# EAGLE design base_board5 (EAGLE 9.1.0)
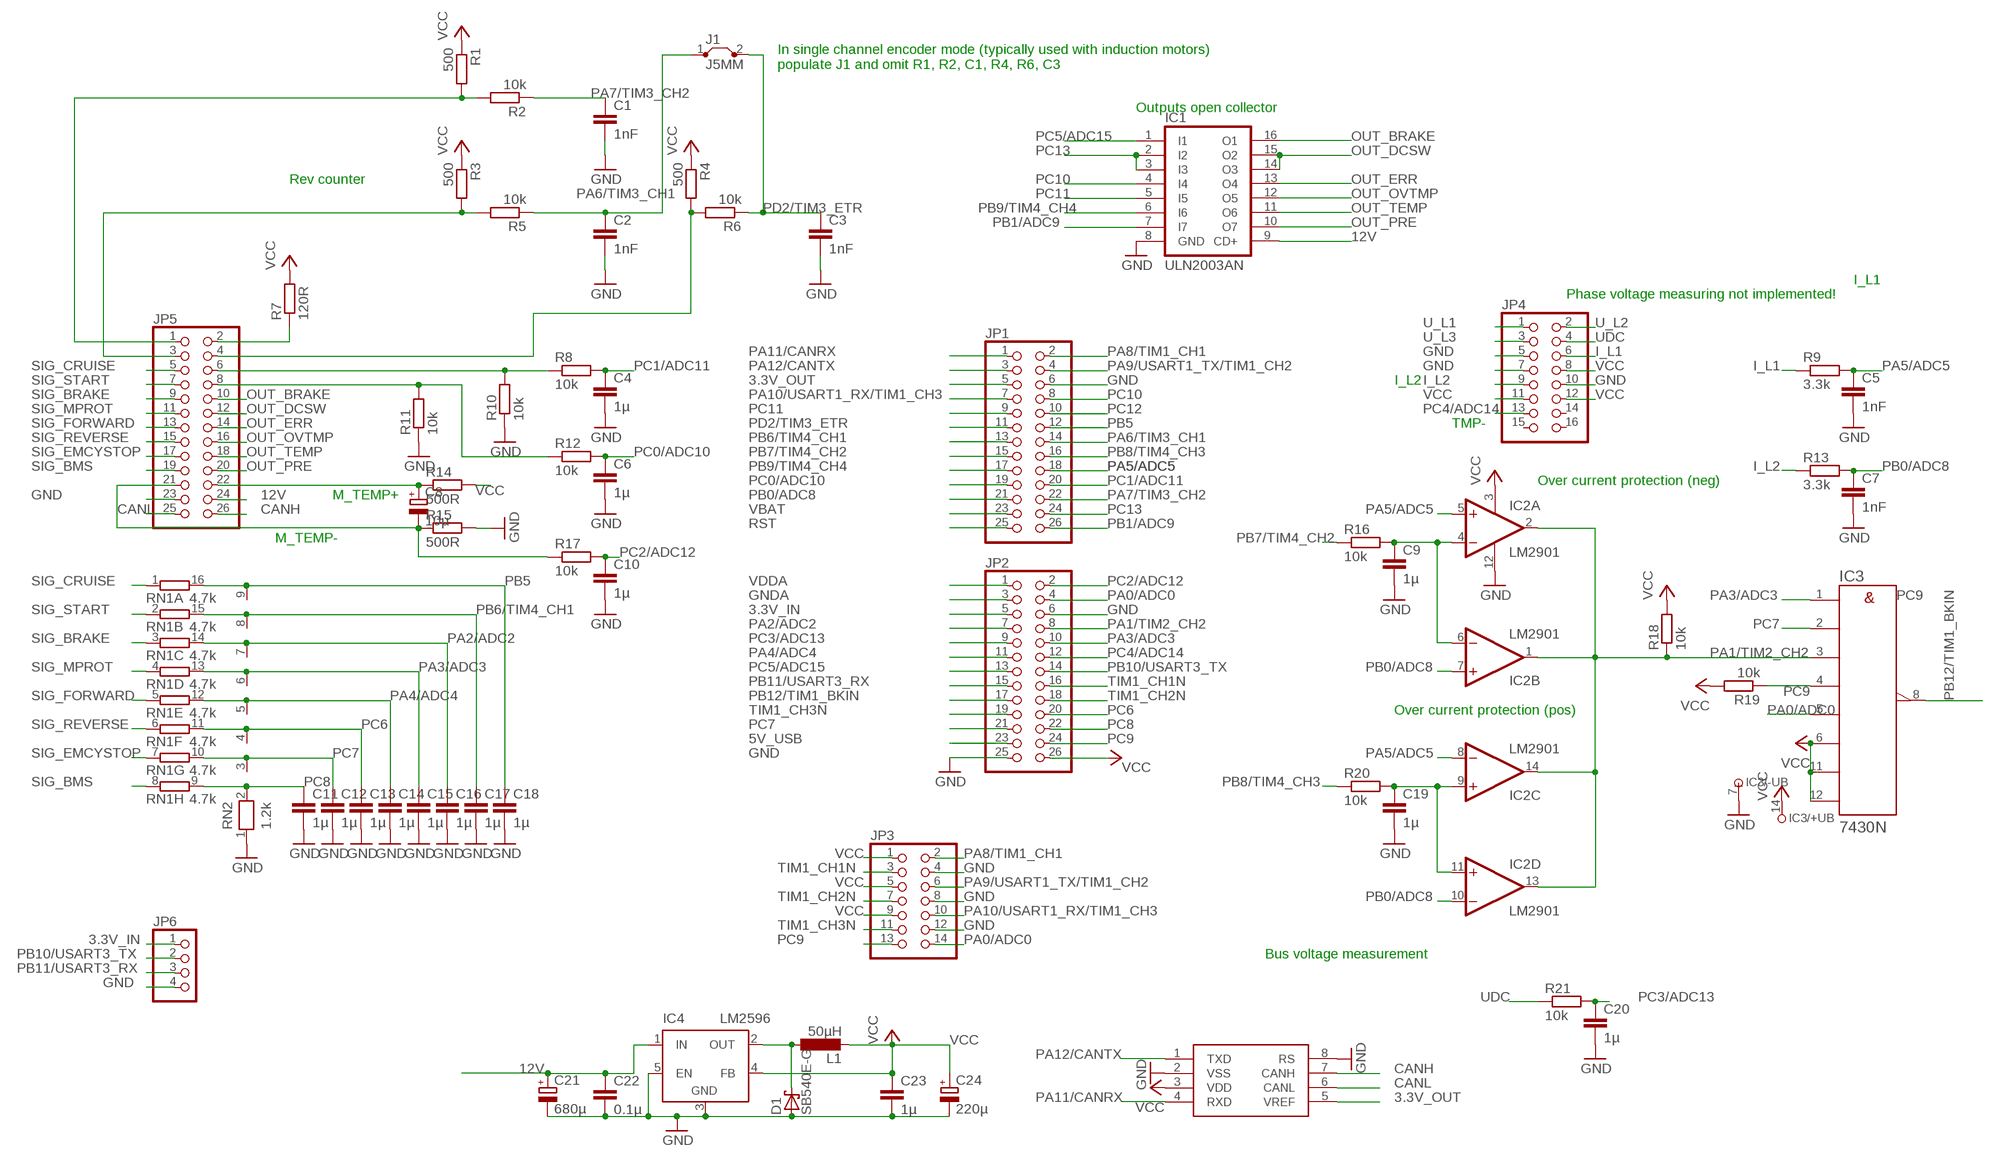
[diagram p0: schematic, sheet 1]

## Parts
C1  1nF  C-EU025-024X044  [C025-024X044]
C2  1nF  C-EU025-024X044  [C025-024X044]
C3  1nF  C-EU025-024X044  [C025-024X044]
C4  1µ  C-EU025-024X044  [C025-024X044]
C5  1nF  C-EU025-024X044  [C025-024X044]
C6  1µ  C-EU025-024X044  [C025-024X044]
C7  1nF  C-EU025-024X044  [C025-024X044]
C8  10µ  CPOL-EUE2-4  [E2-4]
C9  1µ  C-EU025-024X044  [C025-024X044]
C10  1µ  C-EU025-024X044  [C025-024X044]
C11  1µ  C-EU025-024X044  [C025-024X044]
C12  1µ  C-EU025-024X044  [C025-024X044]
C13  1µ  C-EU025-024X044  [C025-024X044]
C14  1µ  C-EU025-024X044  [C025-024X044]
C15  1µ  C-EU025-024X044  [C025-024X044]
C16  1µ  C-EU025-024X044  [C025-024X044]
C17  1µ  C-EU025-024X044  [C025-024X044]
C18  1µ  C-EU025-024X044  [C025-024X044]
C19  1µ  C-EU025-024X044  [C025-024X044]
C20  1µ  C-EU025-024X044  [C025-024X044]
C21  680µ  CPOL-EUE2.5-5  [E2,5-5]
C22  0.1µ  C-EU050-024X044  [C050-024X044]
C23  1µ  C-EU025-024X044  [C025-024X044]
C24  220µ  CPOL-EUE2-4  [E2-4]
D1  SB540E-G  SCHOTTKY-DIODEDO201T15  [DO201T15]
IC1  ULN2003AN  ULN2001AN  [DIL16]
IC2  LM2901  LM339N  [DIL14]
IC3  7430N  [DIL14]
IC4  LM2596  LM2596TV  [TO220-51]
IC5  MCP2562P  MCP2551P  [DIL08]
J1  J5MM  [05]
JP1  PINHD-2X13  [2X13]
JP2  PINHD-2X13  [2X13]
JP3  PINHD-2X7  [2X07]
JP4  PINHD-2X8  [2X08]
JP5  PINHD-2X13  [2X13]
JP6  PINHD-1X4  [1X04]
L1  50µH  L-EUTJ3-U1  [TJ3-U1]
R1  500  R-EU_0207/10  [0207/10]
R2  10k  R-EU_0207/10  [0207/10]
R3  500  R-EU_0207/10  [0207/10]
R4  500  R-EU_0207/10  [0207/10]
R5  10k  R-EU_0207/10  [0207/10]
R6  10k  R-EU_0207/10  [0207/10]
R7  120R  R-EU_0207/10  [0207/10]
R8  10k  R-EU_0207/10  [0207/10]
R9  3.3k  R-EU_0207/10  [0207/10]
R10  10k  R-EU_0207/10  [0207/10]
R11  10k  R-EU_0207/10  [0207/10]
R12  10k  R-EU_0207/10  [0207/10]
R13  3.3k  R-EU_0207/10  [0207/10]
R14  500R  R-EU_0207/10  [0207/10]
R15  500R  R-EU_0207/10  [0207/10]
R16  10k  R-EU_0207/10  [0207/10]
R17  10k  R-EU_0207/10  [0207/10]
R18  10k  R-EU_0207/10  [0207/10]
R19  10k  R-EU_0207/10  [0207/10]
R20  10k  R-EU_0207/10  [0207/10]
R21  10k  R-EU_0207/10  [0207/10]
RN1  4.7k  8R-N  [DIL16]
RN2  1.2k  RN08  [RN-9]

## Nets
3.3V_IN: JP2.5 JP6.1
3.3V_OUT: IC5.5(VREF) JP1.5
5V_USB: JP2.23
12V: C21.+ C22.1 IC1.9(CD+) IC4.1(IN) JP5.24
CANH: IC5.7(CANH) JP5.26
CANL: IC5.6(CANL) JP5.25
GND: C1.2 C2.2 C3.2 C4.2 C5.2 C6.2 C7.2 C9.2 C10.2 C11.2 C12.2 C13.2 C14.2 C15.2 C16.2 C17.2 C18.2 C19.2 C20.2 C21.- C22.2 C23.2 C24.- D1.A IC1.8(GND) IC2.12(P:GND) IC3.7(-UB) IC4.3(GND) IC4.5(EN) IC5.2(VSS) IC5.8(RS) JP1.6 JP2.6 JP2.25 JP3.4 JP3.8 JP3.12 JP4.5 JP4.7 JP4.10 JP5.23 JP6.4 R10.1 R11.1 R15.2 RN2.1
GNDA: JP2.3
I_L1: JP4.6 R9.1
I_L2: JP4.9 R13.1
N$3: JP5.2 R7.1
N$5: JP5.3 R3.2 R5.2
N$8: JP5.1 R1.2 R2.2
N$10: C19.1 IC2.9(C:+IN) IC2.11(D:+IN) R20.2
N$11: JP5.4 R4.2 R6.2
N$13: C8.+ JP5.22 R14.1
N$14: D1.C IC4.2(OUT) L1.1
N$15: C9.1 IC2.4(A:-IN) IC2.6(B:-IN) R16.2
N$16: C8.- JP5.21 R15.1 R17.1
OUT_BRAKE: IC1.16(O1) JP5.10
OUT_DCSW: IC1.14(O3) IC1.15(O2) JP5.12
OUT_ERR: IC1.13(O4) JP5.14
OUT_OVTMP: IC1.12(O5) JP5.16
OUT_PRE: IC1.10(O7) JP5.20
OUT_TEMP: IC1.11(O6) JP5.18
PA0/ADC0: IC3.5(E) JP2.4 JP3.14
PA1/TIM2_CH2: IC2.1(B:OUT) IC2.2(A:OUT) IC2.13(D:OUT) IC2.14(C:OUT) IC3.3(C) JP2.8 R18.1
PA2/ADC2: C16.1 JP2.7 RN1.14 RN2.7
PA3/ADC3: C15.1 IC3.1(A) JP2.10 RN1.13 RN2.6
PA4/ADC4: C14.1 JP2.11 RN1.12 RN2.5
PA5/ADC5: C5.1 IC2.5(A:+IN) IC2.8(C:-IN) JP1.18 R9.2
PA6/TIM3_CH1: C2.1 J1.1 JP1.14 R5.1
PA7/TIM3_CH2: C1.1 JP1.22 R2.1
PA8/TIM1_CH1: JP1.2 JP3.2
PA9/USART1_TX/TIM1_CH2: JP1.4 JP3.6
PA10/USART1_RX/TIM1_CH3: JP1.7 JP3.10
PA11/CANRX: IC5.4(RXD) JP1.1
PA12/CANTX: IC5.1(TXD) JP1.3
PB0/ADC8: C7.1 IC2.7(B:+IN) IC2.10(D:-IN) JP1.21 R13.2
PB1/ADC9: IC1.7(I7) JP1.26
PB5: C18.1 JP1.12 RN1.16 RN2.9
PB6/TIM4_CH1: C17.1 JP1.13 RN1.15 RN2.8
PB7/TIM4_CH2: JP1.15 R16.1
PB8/TIM4_CH3: JP1.16 R20.1
PB9/TIM4_CH4: IC1.6(I6) JP1.17
PB10/USART3_TX: JP2.14 JP6.2
PB11/USART3_RX: JP2.15 JP6.3
PB12/TIM1_BKIN: IC3.8(Y) JP2.17
PC0/ADC10: C6.1 JP1.19 R12.2
PC1/ADC11: C4.1 JP1.20 R8.2
PC2/ADC12: C10.1 JP2.2 R17.2
PC3/ADC13: C20.1 JP2.9 R21.2
PC4/ADC14: JP2.12 JP4.13
PC5/ADC15: IC1.1(I1) JP2.13
PC6: C13.1 JP2.20 RN1.11 RN2.4
PC7: C12.1 IC3.2(B) JP2.21 RN1.10 RN2.3
PC8: C11.1 JP2.22 RN1.9 RN2.2
PC9: IC3.4(D) JP2.24 JP3.13 R19.1
PC10: IC1.4(I4) JP1.8
PC11: IC1.5(I5) JP1.9
PC12: JP1.10
PC13: IC1.2(I2) IC1.3(I3) JP1.24
PD2/TIM3_ETR: C3.1 J1.2 JP1.11 R6.1
RST: JP1.25
SIG_BMS: JP5.19 RN1.8
SIG_BRAKE: JP5.9 RN1.3
SIG_CRUISE: JP5.5 RN1.1
SIG_EMCYSTOP: JP5.17 RN1.7
SIG_FORWARD: JP5.13 RN1.5
SIG_MPROT: JP5.11 RN1.4
SIG_REVERSE: JP5.15 RN1.6
SIG_START: JP5.7 RN1.2
TIM1_CH1N: JP2.16 JP3.3
TIM1_CH2N: JP2.18 JP3.7
TIM1_CH3N: JP2.19 JP3.11
U_L1: JP4.1
U_L2: JP4.2
U_L3: JP4.3
UDC: JP4.4 R21.1
VBAT: JP1.23
VCC: C23.1 C24.+ IC2.3(P:V+) IC3.6(F) IC3.11(G) IC3.12(H) IC3.14(+UB) IC4.4(FB) IC5.3(VDD) JP2.26 JP3.1 JP3.5 JP3.9 JP4.8 JP4.11 JP4.12 L1.2 R1.1 R3.1 R4.1 R7.2 R14.2 R18.2 R19.2
VDDA: JP2.1
X: JP5.6 R8.1 R10.2
Y: JP5.8 R11.2 R12.1
Unconnected: JP4.14 JP4.15 JP4.16

## Notes on the sheet
- In single channel encoder mode (typically used with induction motors)
  populate J1 and omit R1, R2, C1, R4, R6, C3
- Outputs open collector
- Rev counter
- I_L1
- Phase voltage measuring not implemented!
- I_L2
- TMP-
- Over current protection (neg)
- M_TEMP+
- M_TEMP-
- Over current protection (pos)
- Bus voltage measurement

## Library data of the parts
C1-C7 C9-C20 C22 C23 = rcl:C-EU: CAPACITOR, European symbol
C8 C21 C24 = rcl:CPOL-EU: POLARIZED CAPACITOR, European symbol
D1 = diode:SCHOTTKY-DIODE: Schottky Diode
IC1 = uln-udn:ULN2001A: DRIVER ARRAY
IC2 = linear:LM339: Low Power Low Offset Voltage Quad Comparators with open collector; LM139/LM239/LM339/LM2901/LM3302
IC3 = 74ttl-din:74*30: 8-input NAND gate
IC4 = linear:LM2596T: STEP-DOWN VOLTAGE REGULATOR
IC5 = SparkFun-DigitalIC:MCP2551: CAN transceiver
J1 = jumper:J: Bridge
JP1 JP2 JP5 = pinhead:PINHD-2X13: PIN HEADER
JP3 = pinhead:PINHD-2X7: PIN HEADER
JP4 = pinhead:PINHD-2X8: PIN HEADER
JP6 = pinhead:PINHD-1X4: PIN HEADER
L1 = rcl:L-EU: INDUCTOR, European symbol
R1-R21 = rcl:R-EU_: RESISTOR, European symbol
RN1 = resistor-dil:8R-N: DIL RESISTOR
RN2 = resistor-net:RN08: RESISTOR NETWORK

## Board
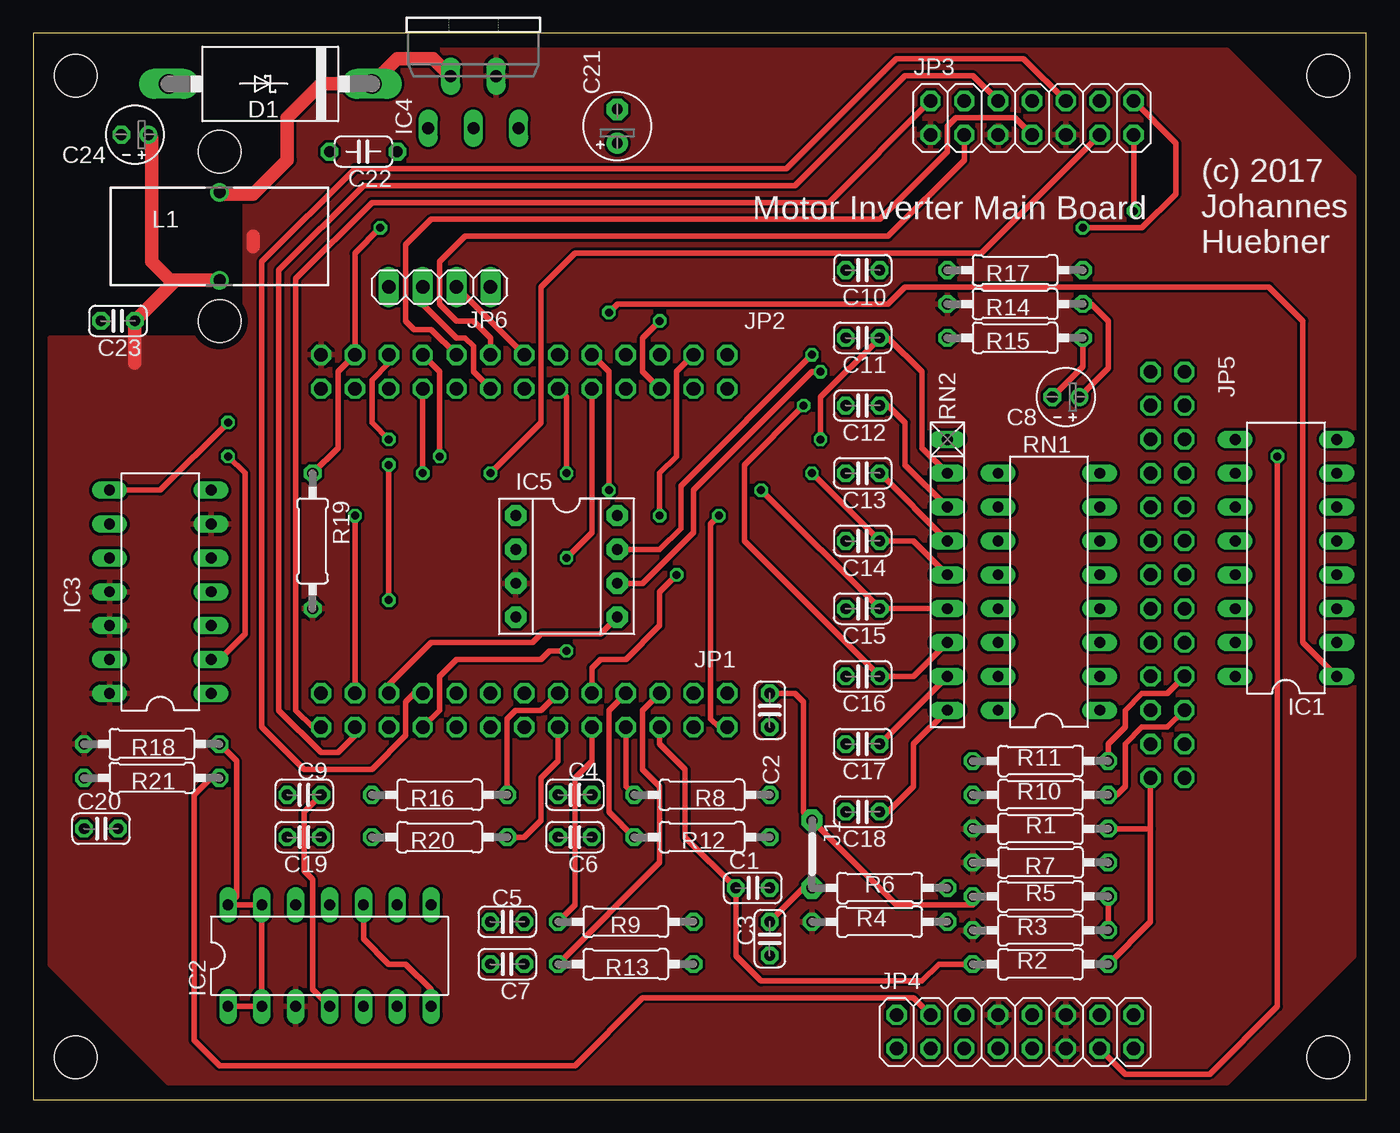
[diagram p1: board, top side]
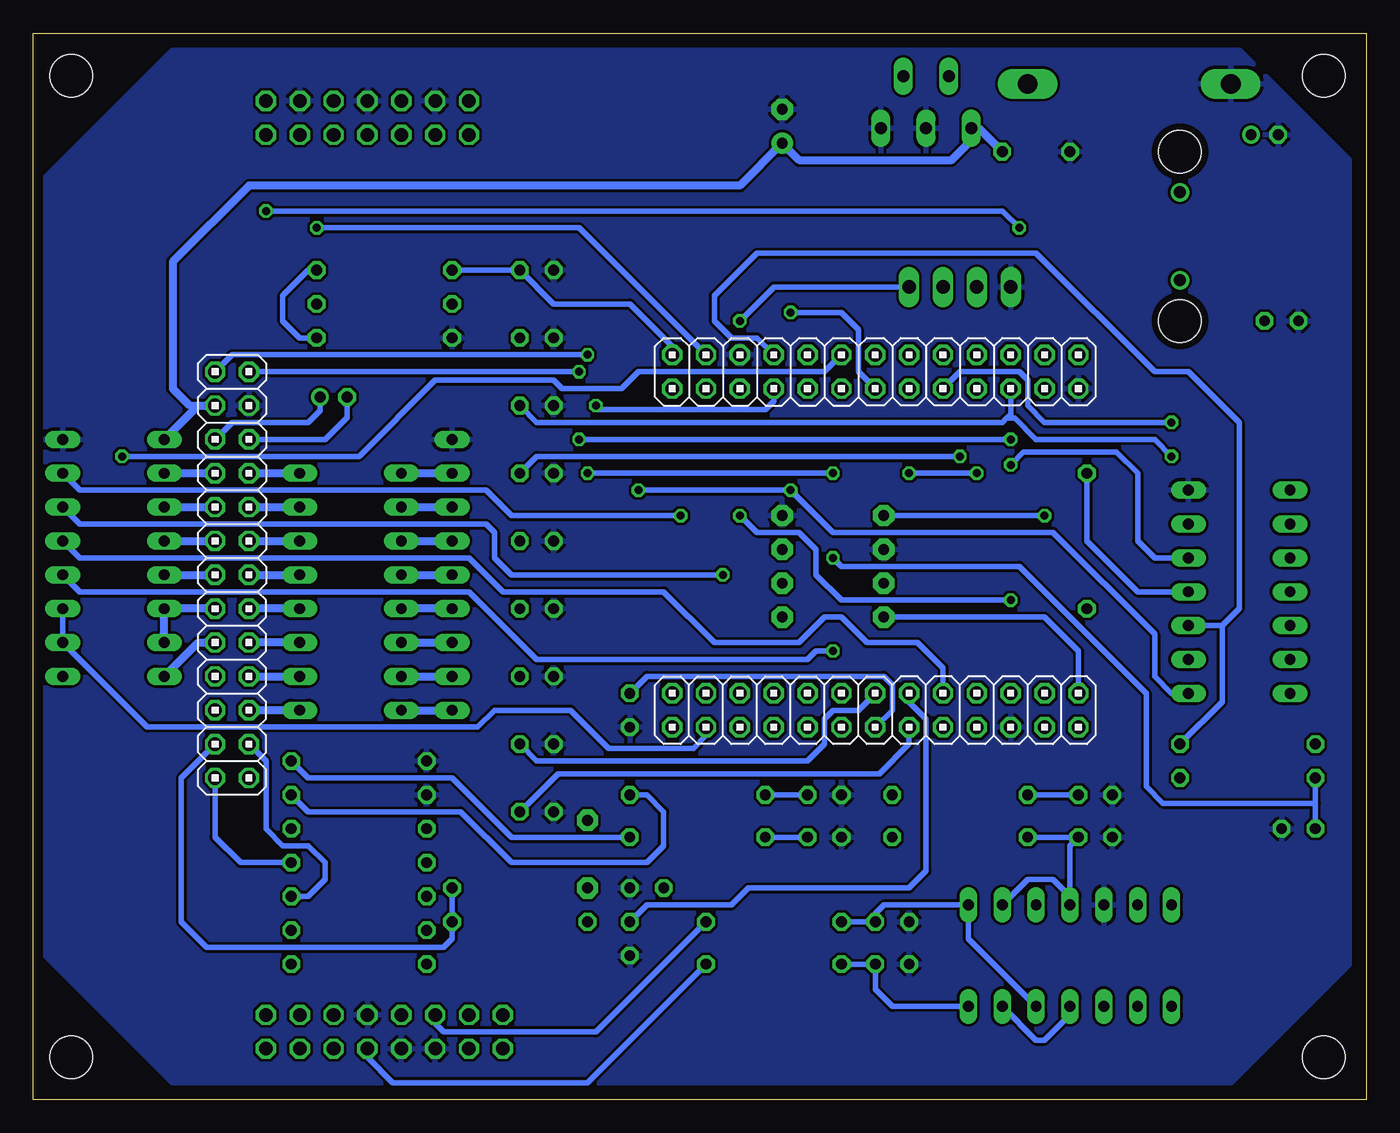
[diagram p2: board, bottom side, seen from below]

Size 100 x 80 mm. Coordinates in mm from the lower left corner, seen from the top.
Outline: 0,0 100,0 100,80 0,80 0,0
Copper layers (1*16): Top 0.035mm / dielectric 1.5mm / Bottom 0.035mm
Design rules "default *": minimum track width 10mil, minimum drill 20mil, track to track 0.2mm, track to pad 0.2mm, pad to pad 0.2mm, via to via 0.2mm, smd to smd 0.2mm, copper to edge 20mil, drill to drill 8mil, minimum pad ring 10mil, minimum via ring 8mil, stop-mask expansion 4mil, vias tented up to drill 0mil, thermal gap 10mil
Holes 3.2 mm at 3.17,76.83 3.17,3.17 97.16,3.17 97.16,76.83 13.97,71.12 13.97,58.42

### Footprints (pad centres in the part's own frame; a part is rotated, then mirrored left to right if it is on the bottom)
C025-024X044 = drill 0.813 octagon: 1 -1.27,0; 2 1.27,0
E2-4 = drill 0.813 pad 1.27: + -1.016,0 | drill 0.813 pad 1.27 octagon: - 1.016,0
E2,5-5 = drill 0.813 pad 1.6: + -1.27,0 | drill 0.813 pad 1.6 octagon: - 1.27,0
C050-024X044 = drill 0.813 octagon: 1 -2.54,0; 2 2.54,0
DO201T15 = drill 1.499 long: A 7.62,0; C -7.62,0
DIL16 = drill 0.813 long: 1 -8.89,-3.81; 2 -6.35,-3.81; 3 -3.81,-3.81; 4 -1.27,-3.81; 5 1.27,-3.81; 6 3.81,-3.81; 7 6.35,-3.81; 8 8.89,-3.81; 9 8.89,3.81; 10 6.35,3.81; 11 3.81,3.81; 12 1.27,3.81; 13 -1.27,3.81; 14 -3.81,3.81; 15 -6.35,3.81; 16 -8.89,3.81
DIL14 = drill 0.813 long: 1 -7.62,-3.81; 2 -5.08,-3.81; 3 -2.54,-3.81; 4 0,-3.81; 5 2.54,-3.81; 6 5.08,-3.81; 7 7.62,-3.81; 8 7.62,3.81; 9 5.08,3.81; 10 2.54,3.81; 11 0,3.81; 12 -2.54,3.81; 13 -5.08,3.81; 14 -7.62,3.81
TO220-51 = drill 0.9 long: 1 -3.4,-8.4; 2 -1.7,-4.5; 3 0,-8.4; 4 1.7,-4.5; 5 3.4,-8.4
DIL08 = drill 0.813 pad 1.6 octagon: 1 -3.81,-3.81; 2 -1.27,-3.81; 3 1.27,-3.81; 4 3.81,-3.81; 5 3.81,3.81; 6 1.27,3.81; 7 -1.27,3.81; 8 -3.81,3.81
05 = drill 0.813 pad 1.6 octagon: 1 -2.54,0; 2 2.54,0
2X13 = drill 1.016 octagon: 1 -15.24,-1.27; 2 -15.24,1.27; 3 -12.7,-1.27; 4 -12.7,1.27; 5 -10.16,-1.27; 6 -10.16,1.27; 7 -7.62,-1.27; 8 -7.62,1.27; 9 -5.08,-1.27; 10 -5.08,1.27; 11 -2.54,-1.27; 12 -2.54,1.27; 13 0,-1.27; 14 0,1.27; 15 2.54,-1.27; 16 2.54,1.27; 17 5.08,-1.27; 18 5.08,1.27; 19 7.62,-1.27; 20 7.62,1.27; 21 10.16,-1.27; 22 10.16,1.27; 23 12.7,-1.27; 24 12.7,1.27; 25 15.24,-1.27; 26 15.24,1.27
2X07 = drill 1.016 octagon: 1 -7.62,-1.27; 2 -7.62,1.27; 3 -5.08,-1.27; 4 -5.08,1.27; 5 -2.54,-1.27; 6 -2.54,1.27; 7 0,-1.27; 8 0,1.27; 9 2.54,-1.27; 10 2.54,1.27; 11 5.08,-1.27; 12 5.08,1.27; 13 7.62,-1.27; 14 7.62,1.27
2X08 = drill 1.016 octagon: 1 -8.89,-1.27; 2 -8.89,1.27; 3 -6.35,-1.27; 4 -6.35,1.27; 5 -3.81,-1.27; 6 -3.81,1.27; 7 -1.27,-1.27; 8 -1.27,1.27; 9 1.27,-1.27; 10 1.27,1.27; 11 3.81,-1.27; 12 3.81,1.27; 13 6.35,-1.27; 14 6.35,1.27; 15 8.89,-1.27; 16 8.89,1.27
1X04 = drill 1.016 long: 1 -3.81,0; 2 -1.27,0; 3 1.27,0; 4 3.81,0
TJ3-U1 = drill 0.9: 1 -3.3,0; 2 3.3,0
0207/10 = drill 0.813 octagon: 1 -5.08,0; 2 5.08,0
RN-9 = drill 0.813 long: 1 -10.16,0; 2 -7.62,0; 3 -5.08,0; 4 -2.54,0; 5 0,0; 6 2.54,0; 7 5.08,0; 8 7.62,0; 9 10.16,0

### Placement (x,y rotation side)
C1  53.98,15.88 0 top
C2  55.24,29.21 270 top
C3  55.24,12.06 270 top
C4  40.64,22.86 180 top
C5  35.56,13.34 180 top
C6  40.64,19.68 180 top
C7  35.56,10.16 180 top
C8  77.47,52.7 180 top
C9  20.32,22.86 180 top
C10  62.23,62.23 180 top
C11  62.23,57.15 180 top
C12  62.23,52.07 180 top
C13  62.23,46.99 180 top
C14  62.23,41.91 180 top
C15  62.23,36.83 180 top
C16  62.23,31.75 180 top
C17  62.23,26.67 180 top
C18  62.23,21.59 180 top
C19  20.32,19.68 180 top
C20  5.08,20.32 0 top
C21  43.81,73.03 90 top
C22  24.77,71.12 180 top
C23  6.35,58.42 180 top
C24  7.62,72.39 180 top
D1  17.78,76.2 180 top
IC1  93.98,40.64 90 top
IC2  22.23,10.79 0 top
IC3  9.53,38.1 90 top
IC4  33.02,81.28 0 top
IC5  40.01,40.01 270 top
J1  58.42,18.41 270 top
JP1  36.83,29.21 180 bottom
JP2  36.83,54.61 0 bottom
JP3  74.93,73.66 0 top
JP4  73.66,5.08 0 top
JP5  85.09,39.37 90 bottom
JP6  30.48,60.96 180 top
L1  13.97,64.77 270 top
R1  75.56,20.32 0 top
R2  75.56,10.16 0 top
R3  75.56,12.7 0 top
R4  63.5,13.34 0 top
R5  75.56,15.24 0 top
R6  63.5,15.88 0 top
R7  75.56,17.78 180 top
R8  50.16,22.86 180 top
R9  44.45,13.34 180 top
R10  75.56,22.86 0 top
R11  75.56,25.4 0 top
R12  50.16,19.68 180 top
R13  44.45,10.16 180 top
R14  73.66,59.69 180 top
R15  73.66,57.15 180 top
R16  30.48,22.86 180 top
R17  73.66,62.23 180 top
R18  8.89,26.67 180 top
R19  20.95,41.91 270 top
R20  30.48,19.68 180 top
R21  8.89,24.13 180 top
RN1  76.2,38.1 90 top
RN2  68.58,39.37 270 top

### Tracks (layer width: path | path; a pad name or v marks a point on that pad's centre or on a via)
3.3V_IN  (via drill 0.6)
  Top 0.406: JP2.5 45.72,54.61 45.72,57.15 v46.99,58.42
  Bottom 0.406: JP6.1 44.45,60.96 v46.99,58.42
3.3V_OUT
  Top 0.406: IC5.5 42.55,34.92 38.1,34.92 37.47,34.29 29.84,34.29 26.67,31.11 JP1.5
12V
  Bottom 0.61: IC1.9 87.63,52.07 | 87.63,52.07 JP5.24 | 87.63,52.07 88.27,52.07 89.53,53.34 89.53,62.87 83.82,68.58 46.99,68.58 C21.+ 42.55,70.48 31.11,70.48 29.62,71.98 IC4.1 29.07,72.88 C22.1
CANH  (via drill 0.6)
  Top 0.406: v58.42,55.88 48.58,46.03 48.58,42.86 46.99,41.27 IC5.7
  Bottom 0.406: JP5.26 85.09,55.88 v58.42,55.88
CANL  (via drill 0.6)
  Top 0.406: v59.05,54.61 58.42,54.61 49.53,45.72 49.53,42.55 45.72,38.73 IC5.6
  Bottom 0.406: JP5.25 v59.05,54.61
GND
  pour Bottom: 1.27,70.48 9.53,78.74 88.27,78.74 89.53,78.74 99.06,69.22 99.06,10.79 89.53,1.27 10.16,1.27 1.27,10.16
I_L1
  Bottom 0.406: R9.1 57.78,5.08 69.22,5.08 69.85,5.71 JP4.6
I_L2
  Bottom 0.406: R13.1 58.42,1.27 73.03,1.27 74.93,3.17 JP4.9
N$3
  Bottom 0.406: JP5.2 86.36,19.68 84.45,17.78 R7.1
N$5
  Top 0.406: R5.2 R3.2
  Bottom 0.406: JP5.3 82.55,25.4 82.55,20.32 81.28,19.05 79.38,19.05 78.11,17.78 78.11,16.51 79.38,15.24 R5.2
N$8
  Top 0.406: R2.2 83.82,13.34 83.82,20.32 | 83.82,20.32 JP5.1 | R1.2 83.82,20.32
N$10
  Bottom 0.406: R20.2 C19.1 22.23,19.05 22.23,15.24 | IC2.9 25.4,16.51 23.5,16.51 22.23,15.24 | 22.23,15.24 IC2.11
N$11
  Bottom 0.406: R6.2 R4.2 68.58,12.06 69.22,11.43 87,11.43 88.9,13.34 88.9,24.13 JP5.4
N$13
  Top 0.406: C8.+ 80.64,54.86 80.64,58.42 79.38,59.69 R14.1
  Bottom 0.406: JP5.22 85.09,50.8 79.38,50.8 78.49,51.69 C8.+
N$14
  Top 1.016: IC4.2 30,78.11 27.3,78.11 D1.C 21.59,76.2 19.05,73.66 19.05,70.48 16.51,67.94 14.1,67.94 L1.1
N$15
  Top 0.406: IC2.4 20.95,8.26 20.95,16.51 20.32,17.14 20.32,21.59 C9.1
  Bottom 0.406: R16.2 C9.1 | IC2.6 24.77,4.45 24.13,4.45 22.23,6.35 IC2.4
N$16
  Top 0.406: C8.- 78.74,54.99 R15.1
  Bottom 0.406: JP5.21 78.11,49.53 76.45,51.18 C8.- | R17.1 79.38,62.23 81.28,60.33 81.28,58.42 80.01,57.15 R15.1
OUT_BRAKE
  Bottom 0.61: IC1.16 87.63,34.29 JP5.10
OUT_DCSW
  Bottom 0.61: JP5.12 IC1.14 IC1.15
OUT_ERR
  Bottom 0.61: IC1.13 JP5.14
OUT_OVTMP
  Bottom 0.61: IC1.12 JP5.16
OUT_PRE
  Bottom 0.61: IC1.10 JP5.20
OUT_TEMP
  Bottom 0.61: IC1.11 JP5.18
PA0/ADC0  (via drill 0.6)
  Top 0.406: JP3.14 85.72,71.75 85.72,67.94 83.19,65.41 v78.74,65.41 | JP2.4 48.26,54.61 48.26,48.26 46.99,46.99 v46.99,43.81 | v26.67,37.47 v26.67,47.62
  Bottom 0.406: v78.74,65.41 59.05,65.41 JP2.4 | v46.99,43.81 45.72,42.55 42.55,42.55 41.27,41.27 41.27,39.37 39.37,37.47 v26.67,37.47 | v26.67,47.62 25.72,48.58 18.73,48.58 17.14,46.99 17.14,41.91 15.88,40.64 IC3.5
PA1/TIM2_CH2
  Top 0.406: IC2.1 IC2.2 IC2.13 IC2.14 15.24,15.24 15.24,25.4 R18.1
  Bottom 0.406: JP2.8 45.72,57.15 47.62,57.15 48.9,58.42 48.9,60.33 45.72,63.5 24.77,63.5 15.88,54.61 13.34,54.61 9.53,50.8 9.53,36.83 10.79,35.56 | 10.79,35.56 IC3.3 | R18.1 10.79,29.84 10.79,35.56
PA2/ADC2  (via drill 0.6)
  Top 0.406: RN2.7 66.04,31.75 C16.1 53.34,41.91 53.34,47.62 v57.78,52.07
  Bottom 0.406: v57.78,52.07 57.47,51.76 45.09,51.76 44.45,52.39 JP2.7
  Bottom 0.61: RN1.14 RN2.7
PA3/ADC3  (via drill 0.6)
  Top 0.406: RN2.6 C15.1 v54.61,45.72 | v43.18,45.72 43.18,54.61 JP2.10
  Bottom 0.406: v54.61,45.72 v43.18,45.72 40.01,42.55 23.5,42.55 15.88,34.92 15.88,31.75 14.61,30.48 IC3.1
  Bottom 0.61: RN2.6 RN1.13
PA4/ADC4  (via drill 0.6)
  Top 0.406: RN2.5 66.04,41.91 C14.1 v58.42,46.99 | v40.01,46.99 40.01,52.7 JP2.11
  Bottom 0.406: v58.42,46.99 v40.01,46.99
  Bottom 0.61: RN1.12 RN2.5
PA5/ADC5
  Top 0.406: R9.2 40.64,14.61 40.64,24.13 41.91,25.4 JP1.18
  Bottom 0.406: R9.2 C5.1 36.83,13.97 36.2,14.61 IC2.8 29.84,12.06 IC2.5
PA6/TIM3_CH1
  Top 0.406: C2.1 57.15,30.48 57.78,29.84 57.78,21.59 J1.1 64.77,14.61 70.48,14.61 R5.1
  Bottom 0.406: C2.1 53.98,31.75 36.2,31.75 35.56,31.11 35.56,29.21 JP1.14
PA7/TIM3_CH2
  Top 0.406: R2.1 67.94,10.16 66.67,8.89 54.61,8.89 52.7,10.79 C1.1 48.9,19.68 48.9,24.77 46.99,26.67 JP1.22
PA8/TIM1_CH1
  Top 0.406: JP3.2 59.69,67.31 25.4,67.31 19.68,61.59 19.68,29.21 20.95,27.94 JP1.2
PA9/USART1_TX/TIM1_CH2
  Top 0.406: JP3.6 70.48,76.83 65.41,76.83 57.15,68.58 24.77,68.58 18.41,62.23 18.41,29.21 21.59,26.04 22.86,26.04 24.13,27.3 JP1.4
PA10/USART1_RX/TIM1_CH3
  Top 0.406: JP3.10 74.3,78.11 64.77,78.11 56.52,69.85 24.13,69.85 17.14,62.87 17.14,27.94 20.32,24.77 25.4,24.77 27.94,27.3 27.94,29.84 28.57,30.48 JP1.7
PA11/CANRX
  Bottom 0.406: IC5.4 24.13,36.2 21.59,33.66 JP1.1
PA12/CANTX  (via drill 0.6)
  Top 0.406: v24.13,43.81 JP1.3
  Bottom 0.406: IC5.1 v24.13,43.81
PB0/ADC8
  Top 0.406: IC2.10 24.77,12.06 26.67,10.16 27.94,10.16 29.84,8.26 IC2.7 | JP1.21 45.72,29.21 45.72,24.77 46.99,23.5 46.99,17.78 R13.2
  Bottom 0.406: R13.2 C7.1 36.83,8.26 35.56,6.99 IC2.7
PB1/ADC9  (via drill 0.6)
  Top 0.406: v51.44,43.81 50.8,43.18 50.8,28.57 51.44,27.94 JP1.26
  Bottom 0.406: IC1.7 96.52,45.72 66.04,45.72 64.14,43.81 v51.44,43.81
PB5
  Top 0.406: RN2.9 66.04,26.67 66.04,23.5 64.14,21.59 C18.1
  Bottom 0.406: C18.1 60.65,24.45 36.52,24.45 34.29,26.67 JP1.12
  Bottom 0.61: RN1.16 RN2.9
PB6/TIM4_CH1
  Top 0.406: RN2.8 C17.1
  Bottom 0.406: C17.1 62.23,25.4 41.91,25.4 40.64,26.67 40.64,28.57 40.01,29.21 38.1,29.21 JP1.13
  Bottom 0.61: RN1.15 RN2.8
PB7/TIM4_CH2
  Top 0.406: R16.1 35.56,28.57 36.2,29.21 38.1,29.21 JP1.15
PB8/TIM4_CH3
  Top 0.406: JP1.16 39.37,25.4 38.1,24.13 38.1,20.95 36.83,19.68 R20.1
PB9/TIM4_CH4  (via drill 0.6)
  Top 0.406: v48.26,39.37 46.99,38.1 46.99,35.56 44.45,33.02 42.55,33.02 41.91,32.38 JP1.17
  Bottom 0.406: IC1.6 96.52,43.18 66.04,43.18 65.41,42.55 65.41,40.64 64.14,39.37 v48.26,39.37
PB10/USART3_TX
  Top 0.406: JP6.2 JP2.14
PB11/USART3_RX
  Top 0.406: JP6.3 29.21,59.69 31.75,57.15 32.38,57.15 33.02,56.52 33.02,54.61 JP2.15
PB12/TIM1_BKIN  (via drill 0.6)
  Top 0.406: v14.61,50.8 9.53,45.72 IC3.8
  Bottom 0.406: JP2.17 30.48,54.61 26.04,54.61 25.4,53.98 25.4,52.07 24.13,50.8 v14.61,50.8
PC0/ADC10
  Top 0.406: R12.2 43.18,21.59 43.18,29.21 JP1.19
  Bottom 0.406: R12.2 C6.1
PC1/ADC11
  Top 0.406: R8.2 44.45,23.5 JP1.20
  Bottom 0.406: R8.2 C4.1
PC2/ADC12
  Bottom 0.406: R17.2 C10.1 60.96,59.69 55.24,59.69 52.07,56.52 JP2.2
PC3/ADC13  (via drill 0.6)
  Top 0.406: JP2.9 41.91,42.55 v40.01,40.64
  Bottom 0.406: v40.01,40.64 39.37,40.01 26.04,40.01 16.51,30.48 16.51,23.5 15.24,22.23 3.81,22.23 | 3.81,22.23 R21.2 | C20.1 3.81,22.23
PC4/ADC14  (via drill 0.6)
  Top 0.406: JP4.13 81.92,1.91 88.27,1.91 93.34,6.99 v93.34,48.26
  Bottom 0.406: v93.34,48.26 75.56,48.26 69.85,53.98 60.96,53.98 60.33,53.34 55.88,53.34 54.61,54.61 40.64,54.61 JP2.12
PC5/ADC15  (via drill 0.6)
  Top 0.406: IC1.1 95.25,34.29 95.25,58.42 92.71,60.96 65.41,60.96 64.14,59.69 43.81,59.69 v43.18,59.05
  Bottom 0.406: v43.18,59.05 39.37,59.05 38.1,57.78 38.1,54.61 JP2.13
PC6  (via drill 0.6)
  Top 0.406: RN2.4 C13.1 | v30.48,48.26 30.48,54.61 JP2.20
  Bottom 0.406: C13.1 62.23,48.26 v30.48,48.26
  Bottom 0.61: RN1.11 RN2.4
PC7  (via drill 0.6)
  Top 0.406: RN2.3 65.41,47.62 65.41,50.8 64.14,52.07 C12.1 | v14.61,48.26 15.88,46.99 15.88,34.92 13.97,33.02 IC3.2
  Bottom 0.406: C12.1 62.23,50.8 27.3,50.8 26.99,51.12 | 26.99,51.12 26.67,51.44 JP2.21 | v14.61,48.26 15.88,49.53 24.77,49.53 26.35,51.12 26.99,51.12
  Bottom 0.61: RN1.10 RN2.3
PC8  (via drill 0.6)
  Top 0.406: RN2.2 66.67,48.9 66.67,54.61 64.14,57.15 C11.1 59.05,52.7 v59.05,49.53 | v26.67,49.53 25.4,50.8 25.4,53.98 26.67,55.24 JP2.22
  Bottom 0.406: v59.05,49.53 v26.67,49.53
  Bottom 0.61: RN1.9 RN2.2
PC9  (via drill 0.6)
  Top 0.406: JP3.13 v82.55,66.67 | v26.04,65.41 24.13,63.5 JP2.24 22.86,54.61 22.86,48.9 R19.1
  Bottom 0.406: v82.55,66.67 27.3,66.67 v26.04,65.41 | R19.1 20.95,41.91 17.14,38.1 IC3.4
PC10  (via drill 0.6)
  Top 0.406: v40.01,33.66 38.73,33.66 38.1,33.02 31.75,33.02 30.48,31.75 30.48,29.21 JP1.8
  Bottom 0.406: IC1.4 96.52,38.1 67.31,38.1 62.23,33.02 41.91,33.02 41.27,33.66 v40.01,33.66
PC11
  Bottom 0.406: IC1.5 96.52,40.64 67.31,40.64 64.77,38.1 52.7,38.1 48.9,34.29 42.55,34.29 40.64,36.2 39.37,36.2 37.47,34.29 33.66,34.29 31.75,32.38 JP1.9
PC13
  Bottom 0.406: IC1.3 IC1.2 91.44,27.94 66.67,27.94 65.41,29.21 59.69,29.21 56.83,26.35 50.48,26.35 49.53,27.3 JP1.24
PD2/TIM3_ETR
  Top 0.406: C3.1 57.78,15.88 J1.2
  Bottom 0.406: C3.1 53.98,14.61 47.62,14.61 46.35,15.88 34.29,15.88 33.02,17.14 33.02,28.57 34.29,29.84 JP1.11
SIG_BMS
  Bottom 0.61: JP5.19 RN1.8
SIG_BRAKE
  Bottom 0.61: RN1.3 JP5.9
SIG_CRUISE
  Bottom 0.61: RN1.1 JP5.5
SIG_EMCYSTOP
  Bottom 0.61: JP5.17 RN1.7
SIG_FORWARD
  Bottom 0.61: JP5.13 RN1.5
SIG_MPROT
  Bottom 0.61: RN1.4 JP5.11
SIG_REVERSE
  Bottom 0.61: JP5.15 RN1.6
SIG_START
  Bottom 0.61: JP5.7 RN1.2
TIM1_CH1N
  Top 0.406: JP2.16 34.29,57.15 33.02,58.42 31.75,58.42 30.48,59.69 30.48,62.87 32.38,64.77 64.14,64.77 69.85,70.48 JP3.3
TIM1_CH2N
  Top 0.406: JP3.7 73.66,73.66 69.22,73.66 68.58,73.03 68.58,71.12 63.5,66.04 29.84,66.04 27.94,64.14 27.94,58.42 28.57,57.78 29.84,57.78 JP2.18
TIM1_CH3N  (via drill 0.6)
  Top 0.406: JP3.11 71.12,63.5 40.64,63.5 38.1,60.96 38.1,50.8 v34.29,46.99 | v29.21,46.99 JP2.19
  Bottom 0.406: v34.29,46.99 v29.21,46.99
UDC
  Top 0.406: JP4.4 66.04,7.62 45.72,7.62 40.64,2.54 13.97,2.54 12.06,4.45 12.06,22.86 13.34,24.13 R21.1
VCC
  Top 1.016: 7.62,55.24 C23.1 10.67,61.47 | 16.51,64.01 16.51,64.77 | C24.+ 8.89,72.14 8.89,62.87 10.29,61.47 10.67,61.47 | 10.67,61.47 L1.2
  pour Top: 1.27,57.15 15.88,57.15 15.88,78.74 89.53,78.74 99.06,69.22 99.06,10.79 89.53,1.27 10.16,1.27 1.27,10.16
X
  Top 0.406: JP5.6 85.09,27.94 83.19,27.94 81.92,26.67 81.92,23.5 81.28,22.86 R10.2
  Bottom 0.406: R10.2 79.38,21.59 67.94,21.59 64.14,17.78 53.98,17.78 52.7,19.05 52.7,21.59 53.98,22.86 R8.1
Y
  Top 0.406: JP5.8 85.09,30.48 83.19,30.48 81.92,29.21 81.92,27.94 80.64,26.67 R11.2
  Bottom 0.406: R11.2 79.38,24.13 68.58,24.13 64.14,19.68 R12.1

### Text on the board
tNames: Motor Inverter Main Board | (c) 2017 / Johannes / Huebner